# EAGLE board node6.9.10-frontend (EAGLE 5.10)
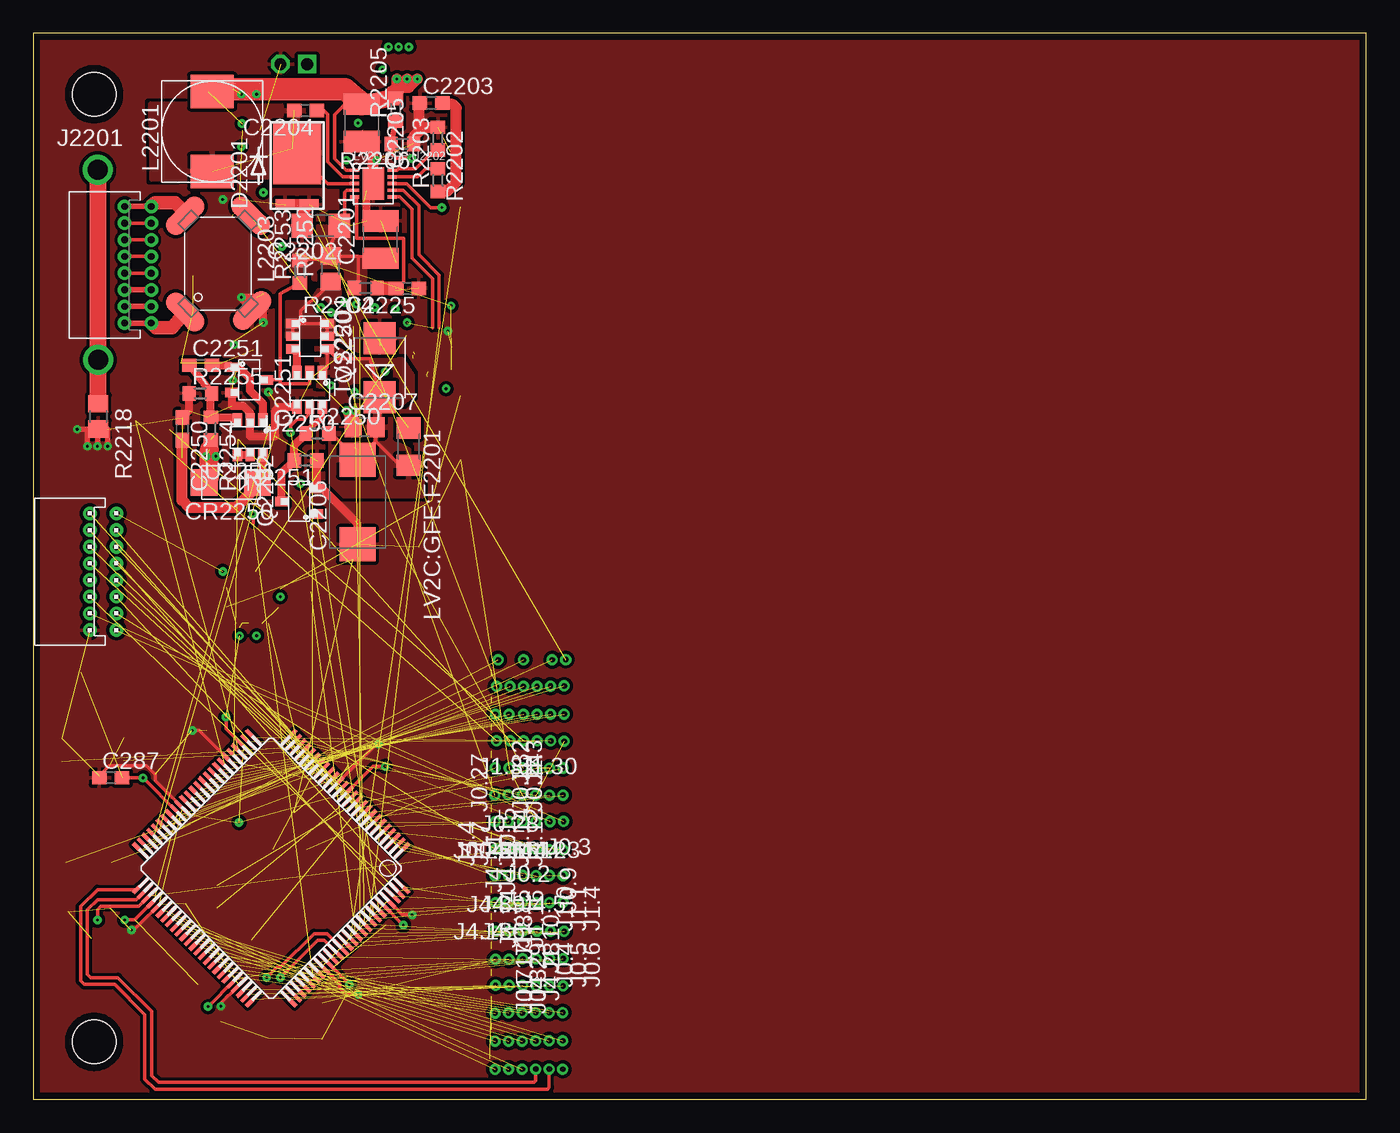
[diagram p2: board, top side]
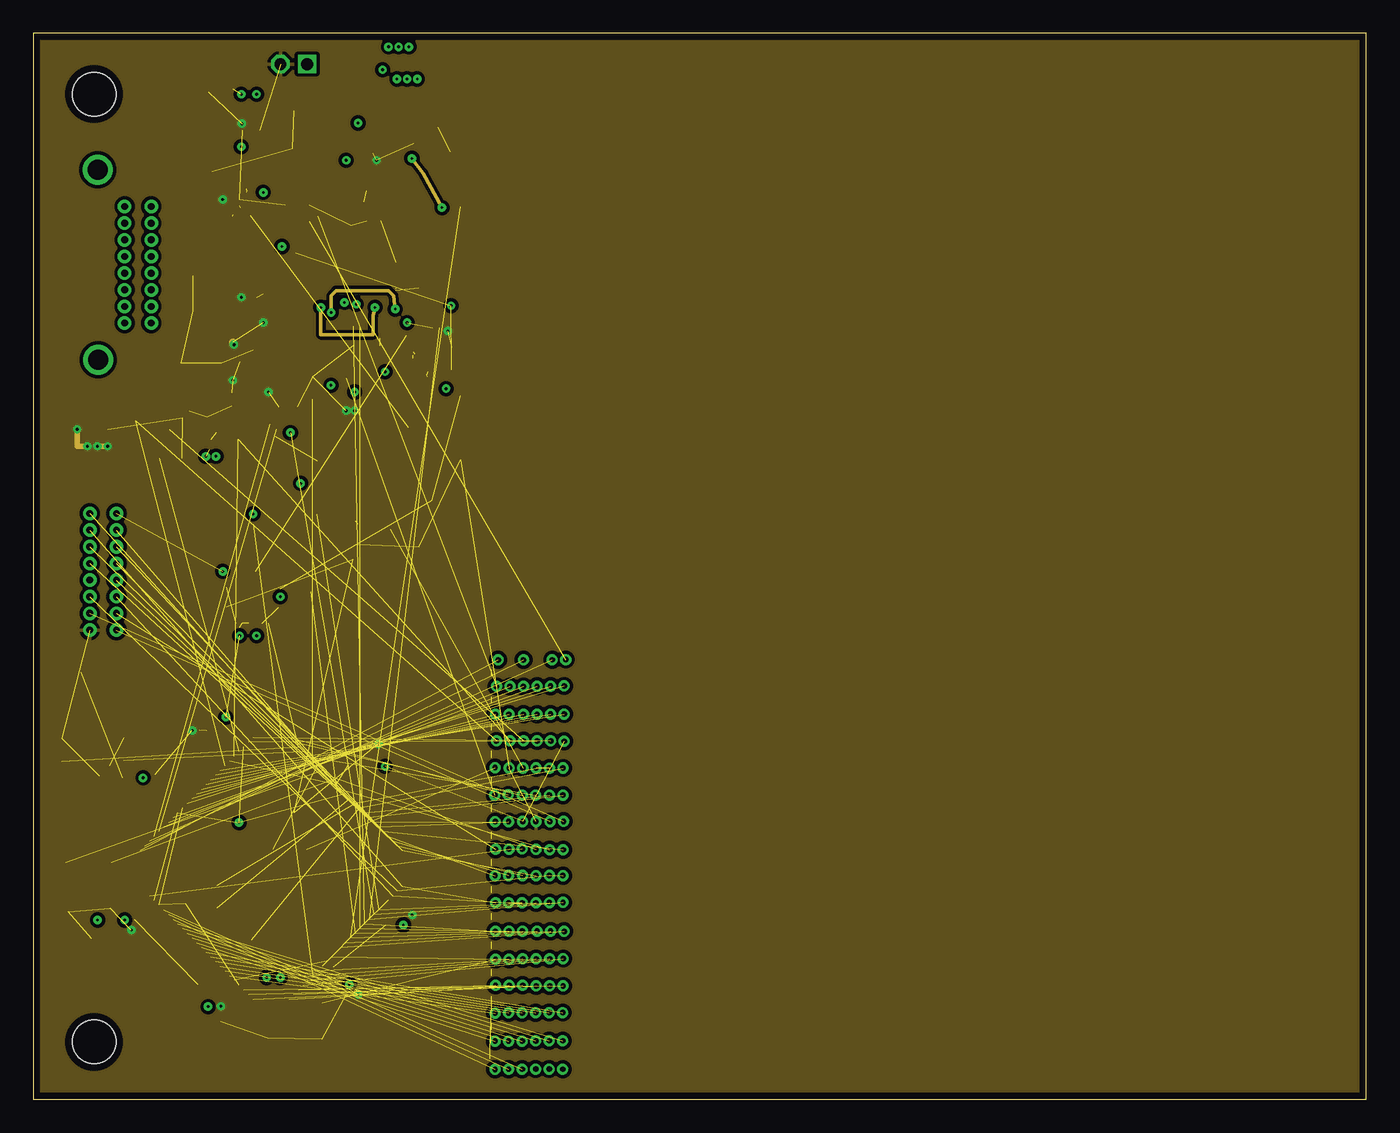
[diagram p3: board, inner layer Route2]
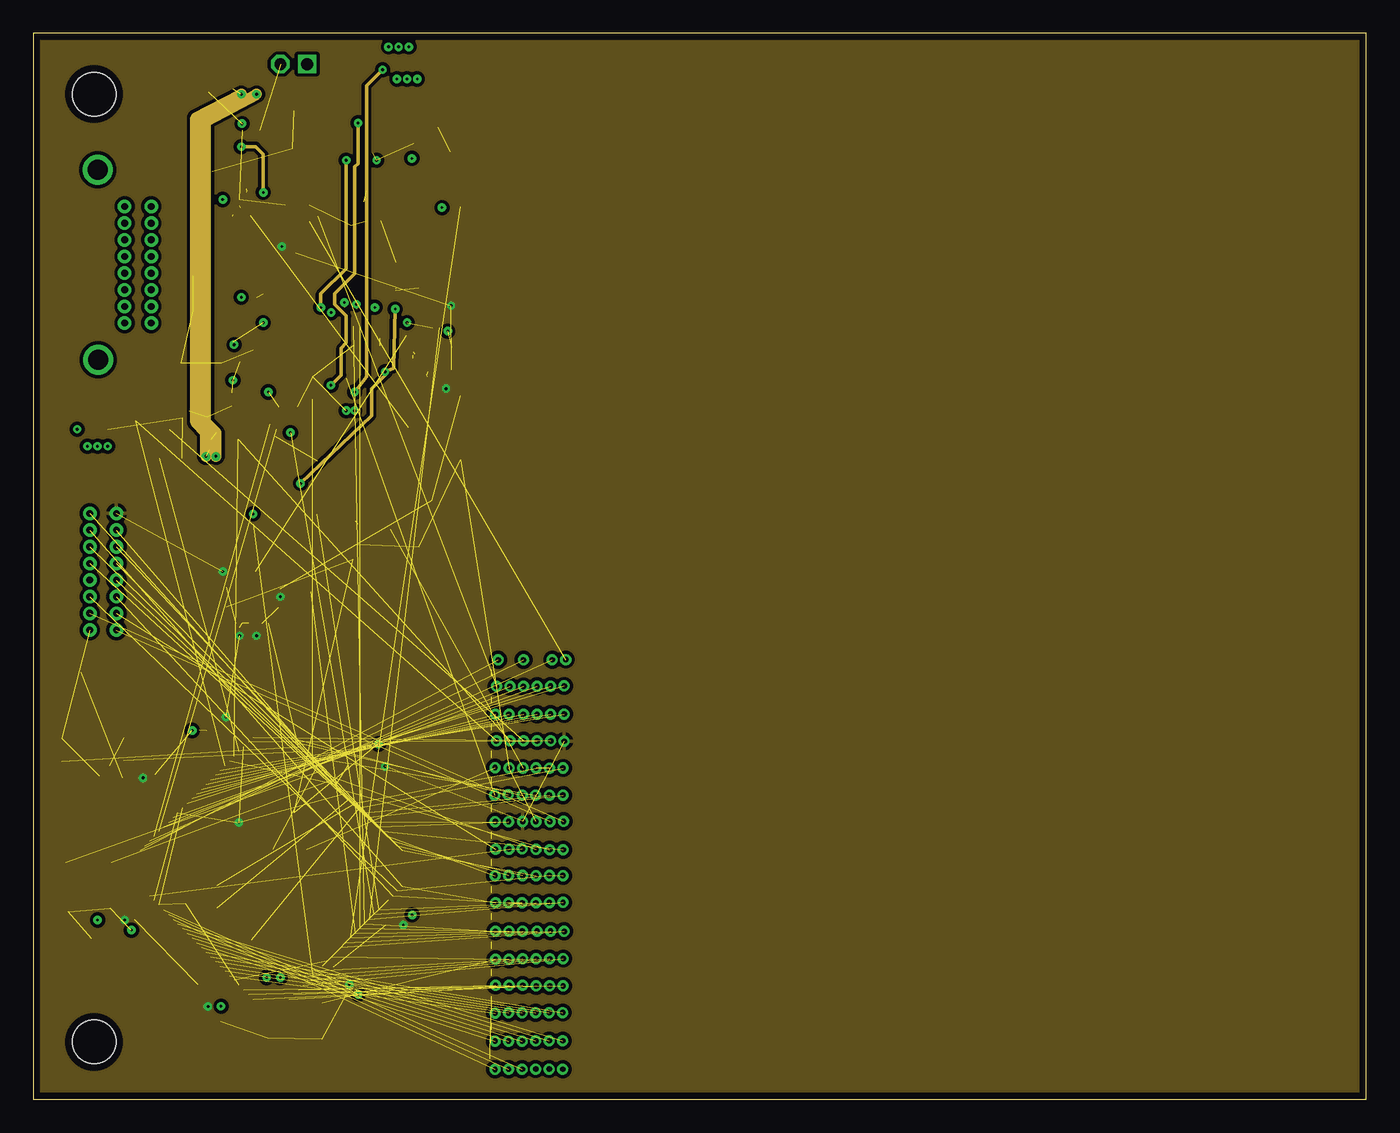
[diagram p4: board, inner layer Route15]
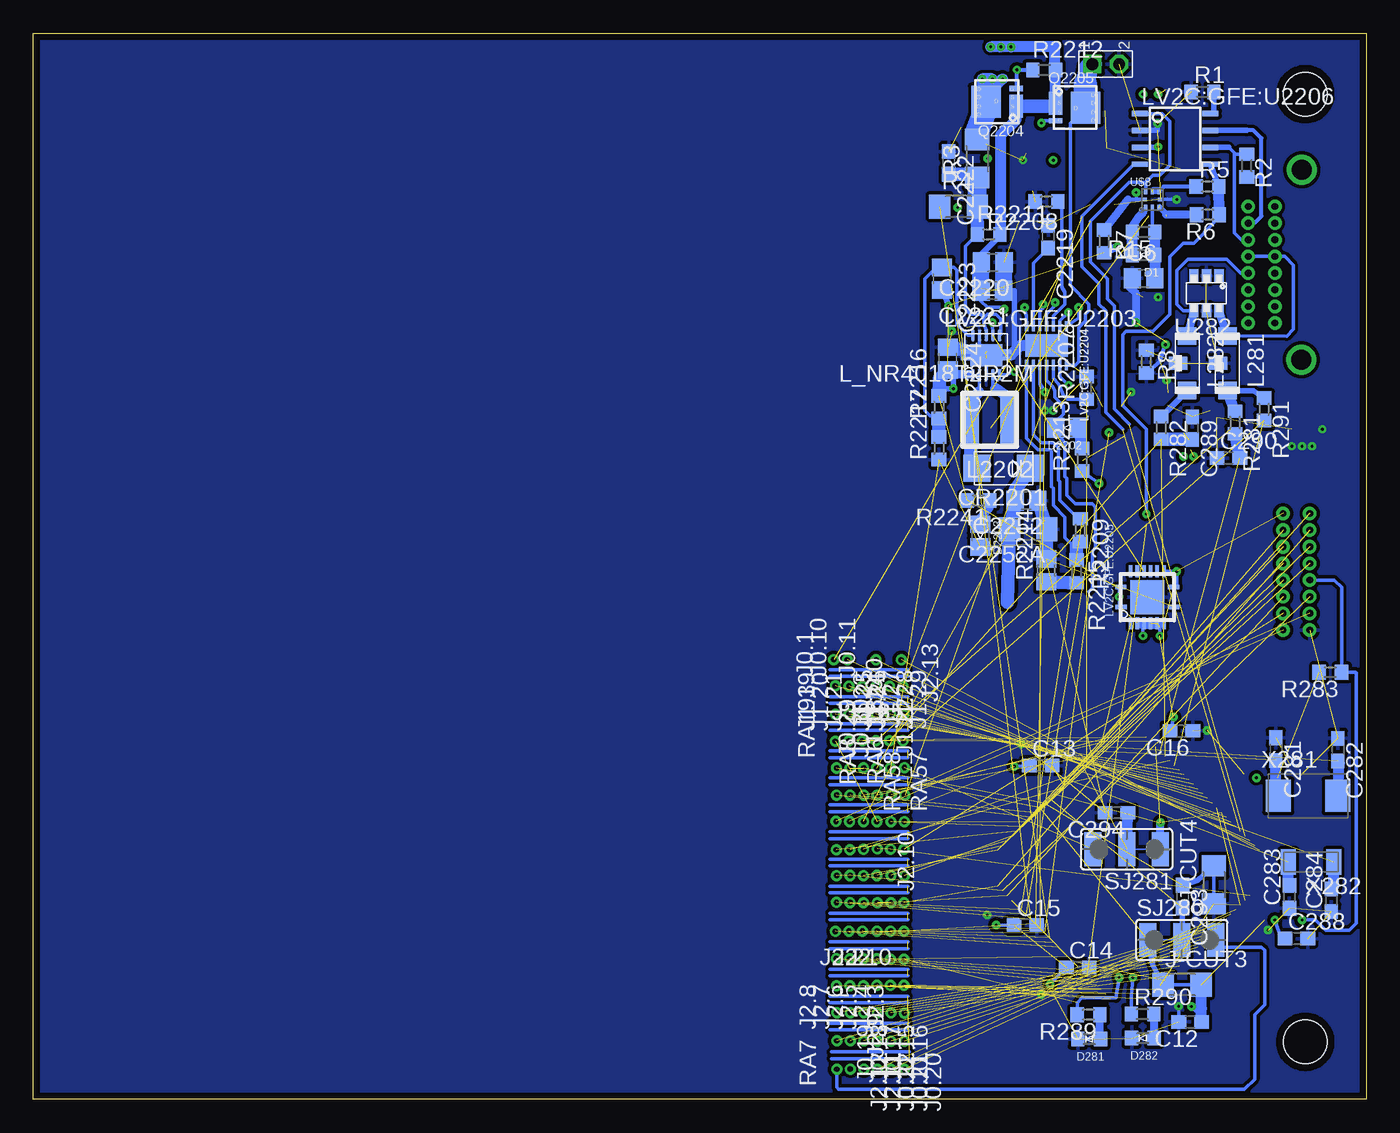
[diagram p5: board, bottom side, seen from below]

Size 100.08 x 80.01 mm. Coordinates in mm from the lower left corner, seen from the top.
Outline: 0,0 100.08,0 100.08,80.01 0,80 0,0
Copper layers (1+2*15+16): Top 0.0432mm / dielectric 0.3048mm / Route2 0.0356mm / dielectric 0.7112mm / Route15 0.0356mm / dielectric 0.3023mm / Bottom 0.0432mm
Design rules "sunstone_4lr_rules_v1.3_modifid *": minimum track width 6mil, minimum drill 8mil, track to track 6mil, track to pad 6mil, pad to pad 6mil, via to via 6mil, smd to smd 6mil, copper to edge 20mil, drill to drill 16mil, minimum pad ring 0.2118mm, minimum via ring 0.2118mm, stop-mask expansion 3mil, vias tented up to drill 0mil, thermal gap 10mil

## Footprints (pad centres in the part's own frame; a part is rotated, then mirrored left to right if it is on the bottom)
2MM-1X2-HEADER = drill 0.889 pad 1.372 square: 1 0,-1 | drill 0.889 pad 1.372 octagon: 2 0,1
C0805 = smd 1.3 x 1.5: 1 -0.85,0; 2 0.85,0
C0603 = smd 1.1 x 1: 1 -0.85,0; 2 0.85,0
C1210 = smd 1.6 x 2.7: 1 -1.4,0; 2 1.4,0
C1206 = smd 1.6 x 1.8: 1 -1.4,0; 2 1.4,0
D/7343-31R = smd 2.55 x 2.7: + 3.175,0; - -3.175,0
NMINIP2-J1 = smd 2 x 2: A 2,0; C -2,0
0603-DIODE = smd 1 x 1.1: A -0.85,0; K 0.85,0
D_POWERDI5 = smd 0.8 x 1.4: ANODE1 -3.47,-0.8; ANODE2 -3.47,1 | smd 4.7 x 3.6: CATHODE 0.4,0.1
0805-DIODE = smd 1.3 x 1.5: 1(ANODE) -0.85,0; 2(CATHODE) 0.85,0
0805-DIODE@1 = smd 1.3 x 1.5: 1(ANODE) -0.85,0; 2(CATHODE) 0.85,0
PAD_ROUND-APC-FREE_0.1/016 = drill 0.406 round: PAD 0,0
ROCKETBUS-PKG = drill 0.508 pad 1.016 round: AUX_1@1 0,-1.875; AUX_1@2 2,-1.875; AUX_2@1 0,-3.125; AUX_2@2 2,-3.125; B+@1 0,4.375; B+@2 2,4.375; B-@1 0,-4.375; B-@2 2,-4.375; CAN_H@1 0,3.125; CAN_H@2 2,3.125; CAN_L@1 0,1.875; CAN_L@2 2,1.875; USB_H@1 0,0.625; USB_H@2 2,0.625; USB_L@1 0,-0.625; USB_L@2 2,-0.625 | drill 1.511 round: CHASSIS@1 -2.032,7.136; CHASSIS@2 -1.982,-7.136
JST-16PS-JED = drill 0.508 pad 1.016 round: 1 4.375,-2; 2 4.375,0; 3 3.125,-2; 4 3.125,0; 5 1.875,-2; 6 1.875,0; 7 0.625,-2; 8 0.625,0; 9 -0.625,-2; 10 -0.625,0; 11 -1.875,-2; 12 -1.875,0; 13 -3.125,-2; 14 -3.125,0; 15 -4.375,-2; 16 -4.375,0
ZJ1206B = smd 1.6 x 1.803: 1 -1.422,0; 2 1.422,0
STAND-OFF = hole 3.302: 0,0
EXC-CET@1 = smd 1.3 x 1.4: 1 -2.05,0; 2 2.05,0 | smd 1 x 1.4: C 0,-0.7
L-DR74 = smd 2.5 x 3.25: 1 -3,0; 2 3,0
L_NR4018 = smd 1.2 x 3.7: 1 -1.4,0; 2 1.4,0
CMS1 = smd 3.5 x 1.5 rotated 45: 1 3.608,-2.462; 3 -3.608,2.462 | smd 3.5 x 1.5 rotated 315: 2 3.508,2.562; 4 -3.608,-2.462
1206 = smd 1.6 x 1.8: 1 -1.4,0; 2 1.4,0
LQFP100 = smd 0.28 x 1.5: #RESET 2,-7.9; #RSTOUT 0.5,-7.9; #TRST -4.5,-7.9; P0[15]/TXD1/SCK0/SCK 0.5,7.9; P0[16]/RXD1/SSEL0/SSEL 0,7.9; P0[17]/CTS1/MISO0/MISO 1,7.9; P0[18]/DCD1/MOSI0/MOSI 1.5,7.9; P0[19]/DSR1/MCICLK/SDA1 2,7.9; P0[20]/DTR1/MCICMD/SCL1 2.5,7.9; P0[21]/RI1/MCIPWR/RD1 3,7.9; P0[22]/RTS1/MCIDAT0/TD1 3.5,7.9; P0[23]/AD0[0]/I2SRX_CLK/CAP3[0] -2,-7.9; P0[24]/AD0[1]/I2SRX_WS/CAP3[1] -2.5,-7.9; P0[25]/AD0[2]/I2SRX_SDA/TXD3 -3,-7.9; P0[26]/AD0[3]/AOUT/RXD3 -3.5,-7.9; P0[27]/SDA0 6,-7.9; P0[28]/SCL0 5.5,-7.9; P1[30]/VBUS/AD0[4] 4,-7.9; P1[31]/SCK1/AD0[5] 3.5,-7.9; P2[0]/PWM1[1]/TXD1/TRACECLK -6,7.9; P2[1]/PWM1[2]/RXD1/PIPESTAT0 -5.5,7.9; P2[2]/PWM1[3]/CTS1/PIPESTAT1 -5,7.9; P2[3]/PWM1[4]/DCD1/PIPESTAT2 -3.5,7.9; P2[4]/PWM1[5]/DSR1/TRACESYNC -3,7.9; P2[5]/PWM1[6]/DTR1/TRACEPKT0 -2.5,7.9; P2[6]/PCAP1[0]/RI1/TRACEPKT1 -2,7.9; P2[7]/RD2/RTS1/TRACEPKT2 -1.5,7.9; P2[8]/TD2/TXD2/TRACEPKT3 -1,7.9; P2[9]/USB_CONNECT/RXD2/EXTIN0 -0.5,7.9; P2[10]/#EINT0 5,7.9; P2[11]/#EINT1/MCIDAT1/I2STX_CLK 5.5,7.9; P2[12]/#EINT2/MCIDAT2/I2STX_WS 6,7.9; RTCX1 1.5,-7.9; RTCX2 2.5,-7.9; TCK -4,-7.9; TDI -5.5,-7.9; TDO -6,-7.9; TMS -5,-7.9; VBAT 3,-7.9; VDD(3V3)@1 4.5,7.9; VDD(3V3)@2 -4,7.9; VDD(DCDC)(3V3) 0,-7.9; VDDA -1.5,-7.9; VREF -0.5,-7.9; VSS 1,-7.9; VSS@3 4,7.9; VSS@4 -4.5,7.9; VSSA -1,-7.9; XTAL1 4.5,-7.9; XTAL2 5,-7.9 | smd 1.5 x 0.28: P0[0]/RD1/TXD3/SDA1 7.9,4; P0[1]/TD1/RXD3/SCL1 7.9,4.5; P0[2]/TXD0 -7.9,-5; P0[3]/RXD0 -7.9,-5.5; P0[4]/I2SRX_CLK/RD2/CAP2[0] -7.9,3.5; P0[5]/I2SRX_WS/TD2/CAP2[1] -7.9,4; P0[6]/I2SRX_SDA/SSEL1/MAT2[0] -7.9,4.5; P0[7]/I2STX_CLK/SCK1/MAT2[1] -7.9,5; P0[8]/I2STX_WS/MISO1/MAT2[2] -7.9,5.5; P0[9]/I2STX_SDA/MOSI1/MAT2[3] -7.9,6; P0[10]/TXD2/SDA2/MAT3[0] 7.9,5; P0[11]/RXD2/SCL2/MAT3[1] 7.9,5.5; P0[29]/USB_D+ 7.9,-4.5; P0[30]/USB_D- 7.9,-4; P1[0]/ENET_TXD0 -7.9,-3.5; P1[1]/ENET_TXD1 -7.9,-3; P1[4]/ENET_TX_EN -7.9,-2.5; P1[8]/ENET_CRS -7.9,-2; P1[9]/ENET_RXD0 -7.9,-1.5; P1[10]/ENET_RXD1 -7.9,-1; P1[14]/ENET_RX_ER -7.9,-0.5; P1[15]/ENET_REF_CLK -7.9,0; P1[16]/ENET_MDC -7.9,0.5; P1[17]/ENET_MDIO -7.9,1; P1[18]/USB_UP_LED/PWM1[1]/CAP1[0] 7.9,-3; P1[19]/CAP1[1] 7.9,-2.5; P1[20]/PWM1[2]/SCK0 7.9,-2; P1[21]/PWM1[3]/SSEL0 7.9,-1.5; P1[22]MAT1[0] 7.9,-1; P1[23]/PWM1[4]/MISO0 7.9,-0.5; P1[24]/PWM1[5]/MOSI0 7.9,0; P1[25]/MAT1[1] 7.9,0.5; P1[26]/PWM1[6]/CAP0[0] 7.9,1; P1[27]/CAP0[1] 7.9,2.5; P1[28]/PCAP1[0]/MAT0[0] 7.9,3; P1[29]/PCAP1[1]/MAT0[1] 7.9,3.5; P2[13]/#EINT3/MCIDAT3/I2STX_SDA 7.9,6; P3[25]/MAT0[0]/PWM1[2] 7.9,-5.5; P3[26]/MAT0[1]/PWM1[3] 7.9,-6; P4[28]/MAT2[0]/TXD3 -7.9,3; P4[29]/MAT2[1]/RXD3 -7.9,1.5; RTCK -7.9,-6; VDD(3V3) 7.9,-5; VDD(3V3)@3 -7.9,-4; VDD(DCDC)(3V3)@1 7.9,2; VDD(DCDC)(3V3)@2 -7.9,2; VSS@1 7.9,-3.5; VSS@2 7.9,1.5; VSS@5 -7.9,-4.5; VSS@6 -7.9,2.5
DFN-10 = smd 0.25 x 0.675: BD -1,-1.413; BOOST -0.5,-1.413; FB 0,1.413; PG 0.5,1.413; RT -1,1.413; RUN/SS 1,-1.413; SW 0,-1.413; SYNC 1,1.413; VC -0.5,1.413; VIN 0.5,-1.413 | smd 2.38 x 1.65: GND 0,0
SON-10 = smd 0.28 x 0.85: EN 1,1.475; FB -1,1.475; GND -0.5,1.475; L1 0.5,-1.475; L2 -0.5,-1.475; PGND 0,-1.475; PS/SYNC 0.5,1.475; VIN 1,-1.475; VINA 0,1.475; VOUT -1,-1.475 | smd 2.4 x 1.65: PGND@1 0,0 | smd 3.8 x 0.28: PGND@2 0,0.25; PGND@3 0,-0.25
DFN-14 = smd 0.25 x 0.7: 1 -1.5,-1.45; 2 -1,-1.45; 3 -0.5,-1.45; 4 0,-1.45; 5 0.5,-1.45; 6 1,-1.45; 7 1.5,-1.45; 8 1.5,1.45; 9 1,1.45; 10 0.5,1.45; 11 0,1.45; 12 -0.5,1.45; 13 -1,1.45; 14 -1.5,1.45 | smd 3.3 x 1.7: PGND 0,0
QFN-16 = smd 0.85 x 0.28: 1 -1.97,-0.75; 8 1.97,-0.74; 9 1.97,0.75; 16 -1.98,0.75 | smd 0.28 x 0.85: 2 -1.25,-1.95; 3 -0.75,-1.95; 4 -0.25,-1.95; 5 0.25,-1.95; 6 0.75,-1.95; 7 1.25,-1.95; 10 1.25,1.95; 11 0.75,1.95; 12 0.25,1.95; 13 -0.25,1.95; 14 -0.75,1.95; 15 -1.25,1.95 | smd 2.55 x 2.55: PGND 0,0
DR-PDSO-G8 = smd 0.4 x 1.2: 1 -1.905,-2.65; 2 -0.635,-2.65; 3 0.635,-2.65; 4 1.905,-2.65; 5 1.905,2.65; 6 0.635,2.65; 7 -0.635,2.65; 8 -1.905,2.65
1212-8_POWERPAK = smd 0.99 x 1.725: 1-2-3 -1.45,0.33 | smd 0.99 x 0.405: 4 -1.45,-0.99 | smd 2.24 x 2.39: 5-6-7-8 0.797,0
SOT23-6 = smd 0.7 x 1: 1 -0.95,-1.3; 2 0,-1.3; 3 0.95,-1.3; 4 0.95,1.3; 5 0,1.3; 6 -0.95,1.3
SOT23-3 = smd 0.7 x 1: 1 -0.95,-1.3; 2 0.95,-1.3; 3 0,1.3
R0603 = smd 1 x 1.1: 1 -0.85,0; 2 0.85,0
R1206 = smd 1.6 x 1.803: 1 -1.422,0; 2 1.422,0
R0805 = smd 1.3 x 1.5: 1 -0.85,0; 2 0.85,0
R0805' = smd 1.3 x 1.5: 1 -0.95,0; 2 0.95,0
SJ_2W = smd 1.27 x 2.54: 1 -2.54,0; 2 0,0; 3 2.54,0
SMB = smd 2.4 x 2.4: A 2.2,0; C -2.2,0
MICROPAK-8 = smd 0.25 x 0.4: 1 -0.5,-0.61; 2 0,-0.61; 3 0.5,-0.61; 5 0.5,0.61; 6 0,0.61; 7 -0.5,0.61 | smd 0.4 x 0.25: 4 0.6,0; 8 -0.6,0
CS10 = smd 1.905 x 2.413: P$1 -2.235,0; P$2 2.235,0
CM415 = smd 1.118 x 1.905: P$1 -1.702,0; P$2 1.702,0

## Placement (x,y rotation side)
B1  BATTERY_SINGLE_CELL_2MM  [2MM-1X2-HEADER]  19.56,77.7 270 bottom
C6  76nF  [C0805]  16.71,61.62 0 bottom
C12  0.1  [C0603]  13.22,5.82 180 bottom
C13  0.1  [C0603]  24.43,25.04 0 bottom
C14  0.1  [C0603]  21.67,9.91 0 bottom
C15  0.1  [C0603]  25.59,13.08 0 bottom
C16  0.1  [C0603]  13.87,27.66 180 bottom
C281  39 pF  [C0603]  6.78,26.29 270 bottom
C282  33 pF  [C0603]  2.13,26.24 270 bottom
C283  22 pF  [C0603]  5.77,15.19 90 bottom
C284  22 pF  [C0603]  2.62,14.94 90 bottom
C287  0.1  [C0603]  5.82,24.13 0 top
C288  0.1  [C0603]  5.23,12.06 0 bottom
C289  18pF  [C0603]  13.06,50.37 270 bottom
C290  18pF  [C0603]  10.34,48.13 0 bottom
C293  0.1  [C0603]  13.79,15.21 270 bottom
C294  0.1  [C0603]  18.75,21.51 180 bottom
C2201  10uF  [C1210]  26.06,64.53 90 top
C2202  1uF  [C1206]  21.59,65.56 180 top
C2203  680pF  [C0603]  29.87,74.77 0 top
C2204  0.22uF  [C0603]  20.44,74.22 180 top
C2205  22uF  [C1210]  24.67,73.28 270 top
C2206  22  [D/7343-31R]  24.35,44.83 90 top
C2207  0.33  [C0805]  24.87,50.44 0 top
C2219  depends on bat  [C0603]  23.88,64.74 270 bottom
C2220  4.7uF  [C0805]  28.04,62.81 180 bottom
C2221  4.7uF  [C0805]  28.07,60.71 180 bottom
C2222  0.1uF  [C0603]  31.34,70.28 270 bottom
C2223  2pF  [C0805]  31.85,61.59 270 bottom
C2224  22uF  [C0805]  31.42,55.6 270 bottom
C2225  0.1uF  [C0603]  28.09,60.86 180 top
C2250  2.7  [C0603]  11.2,50.32 270 top
C2251  0.015  [C0603]  12.57,55.09 0 top
C2252  TBD  [C0805]  25.5,44.93 180 bottom
C2252A  TBD  [C1206]  25.37,42.8 180 bottom
CR2201  MA2Q705  [NMINIP2-J1]  27.23,47.37 180 bottom
CR2250  MA2Q705  [NMINIP2-J1]  14.83,46.3 180 top
D1  CDSU101A  [0603-DIODE]  16.71,63.37 180 bottom
D281  LED-RED-0603  [0603-DIODE]  20.8,4.52 180 bottom
D282  LED-GRN-  [0603-DIODE]  16.76,4.6 180 bottom
D2201  D_PDS340  [D_POWERDI5]  19.91,70.63 90 top
D2202  LED-RED-0805  [0805-DIODE]  22.48,50.39 180 bottom
D2203  LED-ORG-0805  [0805-DIODE@1]  28.98,42.32 270 bottom
J0.0  PAD_ROUND016  [PAD_ROUND-APC-FREE_0.1/016]  34.77,30.99 90 bottom
J0.1  PAD_ROUND016  [PAD_ROUND-APC-FREE_0.1/016]  39.98,33.01 90 bottom
J0.2  PAD_ROUND016  [PAD_ROUND-APC-FREE_0.1/016]  36.7,14.76 0 top
J0.3  PAD_ROUND016  [PAD_ROUND-APC-FREE_0.1/016]  39.76,16.79 0 top
J0.4  PAD_ROUND016  [PAD_ROUND-APC-FREE_0.1/016]  37.76,10.54 270 top
J0.5  PAD_ROUND016  [PAD_ROUND-APC-FREE_0.1/016]  38.77,10.55 270 top
J0.6  PAD_ROUND016  [PAD_ROUND-APC-FREE_0.1/016]  39.79,10.57 270 top
J0.7  PAD_ROUND016  [PAD_ROUND-APC-FREE_0.1/016]  34.71,8.55 270 top
J0.8  PAD_ROUND016  [PAD_ROUND-APC-FREE_0.1/016]  35.73,8.55 270 top
J0.9  PAD_ROUND016  [PAD_ROUND-APC-FREE_0.1/016]  36.74,8.56 270 top
J0.10  PAD_ROUND016  [PAD_ROUND-APC-FREE_0.1/016]  38.96,32.99 90 bottom
J0.11  PAD_ROUND016  [PAD_ROUND-APC-FREE_0.1/016]  36.8,32.98 90 bottom
J0.15  PAD_ROUND016  [PAD_ROUND-APC-FREE_0.1/016]  36.7,4.37 270 bottom
J0.16  PAD_ROUND016  [PAD_ROUND-APC-FREE_0.1/016]  35.69,4.37 270 bottom
J0.17  PAD_ROUND016  [PAD_ROUND-APC-FREE_0.1/016]  37.72,4.38 270 bottom
J0.18  PAD_ROUND016  [PAD_ROUND-APC-FREE_0.1/016]  38.73,4.39 270 bottom
J0.19  PAD_ROUND016  [PAD_ROUND-APC-FREE_0.1/016]  39.75,4.39 270 bottom
J0.20  PAD_ROUND016  [PAD_ROUND-APC-FREE_0.1/016]  34.67,2.25 270 bottom
J0.21  PAD_ROUND016  [PAD_ROUND-APC-FREE_0.1/016]  35.69,2.26 270 bottom
J0.22  PAD_ROUND016  [PAD_ROUND-APC-FREE_0.1/016]  36.7,2.26 270 bottom
J0.23  PAD_ROUND016  [PAD_ROUND-APC-FREE_0.1/016]  38.75,22.83 90 top
J0.24  PAD_ROUND016  [PAD_ROUND-APC-FREE_0.1/016]  39.76,22.83 90 top
J0.25  PAD_ROUND016  [PAD_ROUND-APC-FREE_0.1/016]  34.68,20.84 180 top
J0.26  PAD_ROUND016  [PAD_ROUND-APC-FREE_0.1/016]  35.69,20.84 180 top
J0.27  PAD_ROUND016  [PAD_ROUND-APC-FREE_0.1/016]  35.66,22.85 90 top
J0.28  PAD_ROUND016  [PAD_ROUND-APC-FREE_0.1/016]  36.72,22.83 180 top
J0.29  PAD_ROUND016  [PAD_ROUND-APC-FREE_0.1/016]  36.8,26.91 90 bottom
J0.30  PAD_ROUND016  [PAD_ROUND-APC-FREE_0.1/016]  35.79,26.91 90 bottom
J1.0  PAD_ROUND016  [PAD_ROUND-APC-FREE_0.1/016]  37.74,14.75 270 top
J1.1  PAD_ROUND016  [PAD_ROUND-APC-FREE_0.1/016]  38.76,14.76 270 top
J1.2  PAD_ROUND016  [PAD_ROUND-APC-FREE_0.1/016]  38.75,24.85 90 top
J1.3  PAD_ROUND016  [PAD_ROUND-APC-FREE_0.1/016]  39.76,24.87 90 top
J1.4  PAD_ROUND016  [PAD_ROUND-APC-FREE_0.1/016]  39.77,14.78 270 top
J1.8  PAD_ROUND016  [PAD_ROUND-APC-FREE_0.1/016]  34.69,12.62 270 top
J1.9  PAD_ROUND016  [PAD_ROUND-APC-FREE_0.1/016]  35.71,12.63 270 top
J1.10  PAD_ROUND016  [PAD_ROUND-APC-FREE_0.1/016]  36.72,12.63 270 top
J1.14  PAD_ROUND016  [PAD_ROUND-APC-FREE_0.1/016]  37.82,12.62 90 top
J1.15  PAD_ROUND016  [PAD_ROUND-APC-FREE_0.1/016]  38.84,12.62 90 top
J1.16  PAD_ROUND016  [PAD_ROUND-APC-FREE_0.1/016]  39.85,12.61 90 top
J1.17  PAD_ROUND016  [PAD_ROUND-APC-FREE_0.1/016]  34.71,10.5 270 top
J1.18  PAD_ROUND016  [PAD_ROUND-APC-FREE_0.1/016]  34.77,26.9 90 bottom
J1.19  PAD_ROUND016  [PAD_ROUND-APC-FREE_0.1/016]  39.85,28.92 90 bottom
J1.20  PAD_ROUND016  [PAD_ROUND-APC-FREE_0.1/016]  38.84,28.92 90 bottom
J1.21  PAD_ROUND016  [PAD_ROUND-APC-FREE_0.1/016]  37.82,28.91 90 bottom
J1.22  PAD_ROUND016  [PAD_ROUND-APC-FREE_0.1/016]  36.8,28.89 270 bottom
J1.23  PAD_ROUND016  [PAD_ROUND-APC-FREE_0.1/016]  35.71,28.91 90 bottom
J1.24  PAD_ROUND016  [PAD_ROUND-APC-FREE_0.1/016]  34.7,28.91 90 bottom
J1.25  PAD_ROUND016  [PAD_ROUND-APC-FREE_0.1/016]  39.85,31.03 270 bottom
J1.26  PAD_ROUND016  [PAD_ROUND-APC-FREE_0.1/016]  38.84,31.01 270 bottom
J1.27  PAD_ROUND016  [PAD_ROUND-APC-FREE_0.1/016]  37.82,31 270 bottom
J1.28  PAD_ROUND016  [PAD_ROUND-APC-FREE_0.1/016]  36.8,30.99 270 bottom
J1.29  PAD_ROUND016  [PAD_ROUND-APC-FREE_0.1/016]  35.79,30.99 270 bottom
J1.30  PAD_ROUND016  [PAD_ROUND-APC-FREE_0.1/016]  37.71,22.83 0 top
J1.31  PAD_ROUND016  [PAD_ROUND-APC-FREE_0.1/016]  34.65,22.83 0 top
J2.0  PAD_ROUND016  [PAD_ROUND-APC-FREE_0.1/016]  37.76,8.51 0 bottom
J2.1  PAD_ROUND016  [PAD_ROUND-APC-FREE_0.1/016]  38.77,8.51 0 bottom
J2.2  PAD_ROUND016  [PAD_ROUND-APC-FREE_0.1/016]  39.78,8.51 0 bottom
J2.3  PAD_ROUND016  [PAD_ROUND-APC-FREE_0.1/016]  34.67,6.48 90 bottom
J2.4  PAD_ROUND016  [PAD_ROUND-APC-FREE_0.1/016]  35.69,6.49 90 bottom
J2.5  PAD_ROUND016  [PAD_ROUND-APC-FREE_0.1/016]  36.7,6.49 90 bottom
J2.6  PAD_ROUND016  [PAD_ROUND-APC-FREE_0.1/016]  37.72,6.5 90 bottom
J2.7  PAD_ROUND016  [PAD_ROUND-APC-FREE_0.1/016]  38.73,6.52 90 bottom
J2.8  PAD_ROUND016  [PAD_ROUND-APC-FREE_0.1/016]  39.75,6.52 90 bottom
J2.9  PAD_ROUND016  [PAD_ROUND-APC-FREE_0.1/016]  34.67,4.37 90 bottom
J2.10  PAD_ROUND016  [PAD_ROUND-APC-FREE_0.1/016]  36.7,18.8 270 bottom
J2.11  PAD_ROUND016  [PAD_ROUND-APC-FREE_0.1/016]  37.72,2.27 270 bottom
J2.12  PAD_ROUND016  [PAD_ROUND-APC-FREE_0.1/016]  38.73,2.27 270 bottom
J2.13  PAD_ROUND016  [PAD_ROUND-APC-FREE_0.1/016]  34.9,32.98 270 bottom
J3.25  PAD_ROUND016  [PAD_ROUND-APC-FREE_0.1/016]  37.83,26.9 0 bottom
J3.26  PAD_ROUND016  [PAD_ROUND-APC-FREE_0.1/016]  38.85,26.9 0 bottom
J4.1  PAD_ROUND016  [PAD_ROUND-APC-FREE_0.1/016]  37.74,20.85 180 top
J4.2  PAD_ROUND016  [PAD_ROUND-APC-FREE_0.1/016]  38.79,20.85 180 top
J4.3  PAD_ROUND016  [PAD_ROUND-APC-FREE_0.1/016]  39.81,20.87 180 top
J4.4  PAD_ROUND016  [PAD_ROUND-APC-FREE_0.1/016]  34.7,18.77 90 top
J4.5  PAD_ROUND016  [PAD_ROUND-APC-FREE_0.1/016]  38.75,16.8 180 top
J4.6  PAD_ROUND016  [PAD_ROUND-APC-FREE_0.1/016]  35.69,14.76 180 top
J4.7  PAD_ROUND016  [PAD_ROUND-APC-FREE_0.1/016]  35.71,18.78 90 top
J4.8  PAD_ROUND016  [PAD_ROUND-APC-FREE_0.1/016]  34.67,16.79 180 top
J4.9  PAD_ROUND016  [PAD_ROUND-APC-FREE_0.1/016]  35.69,16.8 180 top
J4.10  PAD_ROUND016  [PAD_ROUND-APC-FREE_0.1/016]  37.74,16.79 90 top
J4.11  PAD_ROUND016  [PAD_ROUND-APC-FREE_0.1/016]  36.74,16.8 90 top
J4.12  PAD_ROUND016  [PAD_ROUND-APC-FREE_0.1/016]  39.79,18.73 90 top
J4.13  PAD_ROUND016  [PAD_ROUND-APC-FREE_0.1/016]  34.7,14.76 180 top
J4.14  PAD_ROUND016  [PAD_ROUND-APC-FREE_0.1/016]  38.77,18.73 90 top
J4.15  PAD_ROUND016  [PAD_ROUND-APC-FREE_0.1/016]  37.74,18.76 90 top
J4.16  PAD_ROUND016  [PAD_ROUND-APC-FREE_0.1/016]  36.74,20.85 180 top
J4.28  PAD_ROUND016  [PAD_ROUND-APC-FREE_0.1/016]  36.74,10.54 270 top
J4.29  PAD_ROUND016  [PAD_ROUND-APC-FREE_0.1/016]  35.71,10.5 270 top
J2201  ROCKETBUS  [ROCKETBUS-PKG]  6.86,62.64 0 top
J2204  JST-16PS-JED  [JST-16PS-JED]  4.24,39.6 90 top
J-CUT3  J_CUT_1206  [ZJ1206B]  13.82,8.61 0 bottom
J-CUT4  J_CUT_1206  [ZJ1206B]  11.43,16.1 90 bottom
JP1  STAND-OFF  [STAND-OFF]  4.57,75.44 0 top
JP2  STAND-OFF  [STAND-OFF]  4.57,4.32 0 top
L281  EXC-CET471U  [EXC-CET@1]  10.41,55.24 270 bottom
L282  FILTER_EMI-EXC-CET  [EXC-CET@1]  13.44,55.24 270 bottom
L2201  L_DR74-6R8-R  [L-DR74]  13.43,72.64 90 top
L2202  L_NR4018T2R2M  [L_NR4018]  28.27,51.01 180 bottom
L2203  CMS1  [CMS1]  13.87,62.71 270 top
LV2C:GFE:F2201  2.0A Fast  [1206]  28.17,49 270 top
LV2C:GFE:U2201  IC_LPC2368  [LQFP100]  17.86,17.35 135 top
LV2C:GFE:U2202  IC_LT3972  [DFN-10]  25.52,68.74 270 top
LV2C:GFE:U2203  IC_TPS63000  [SON-10]  28.53,55.86 0 bottom
LV2C:GFE:U2204  IC_LTC4085  [DFN-14]  24,56.56 180 bottom
LV2C:GFE:U2205  IC_SN74LV163A  [QFN-16]  16.43,37.69 0 bottom
LV2C:GFE:U2206  IC_SN65HVD235  [DR-PDSO-G8]  14.35,72.09 270 bottom
Q2204  P-MOS_SI7123DN  [1212-8_POWERPAK]  27.73,74.87 180 bottom
Q2205  P-MOS_SI7123DN  [1212-8_POWERPAK]  21.86,74.43 0 bottom
Q2250  ZXMP6A17E6TA  [SOT23-6]  20.78,57.28 270 top
Q2251  BSS123E6327  [SOT23-3]  16.21,54 270 top
Q2282  BSS123E6327  [SOT23-3]  19.96,44.88 90 top
R1  18k  [R0603]  12.29,75.62 0 bottom
R2  60  [R0603]  8.97,70.08 270 bottom
R3  100k  [R1206]  29.21,70.61 90 bottom
R4  100k  [R1206]  30.61,67.01 0 bottom
R5  0  [R0603]  11.91,68.5 0 bottom
R6  0  [R0603]  11.89,66.4 180 bottom
R7  0  [R0603]  19.68,64.39 270 bottom
R8  0  [R0603]  16.51,55.37 270 bottom
R15  10k  [R0603]  16.71,65.1 180 bottom
R281  33.2  [R0603]  9.86,50.8 270 bottom
R282  33.2  [R0603]  15.39,50.39 270 bottom
R283  10.0k  [R0603]  2.69,32.05 180 bottom
R289  649  [R0603]  20.85,6.35 180 bottom
R290  649  [R0603]  16.79,6.4 0 bottom
R291  1.5k  [R0603]  7.67,51.79 270 bottom
R2202  26.7k  [R0603]  30.37,72.11 270 top
R2203  15k  [R0603]  30.38,68.99 90 top
R2204  500k  [R0603]  24.97,60.89 180 top
R2205  532k  [R0603]  27.21,74.27 90 top
R2206  100k  [R0603]  27.71,71.71 180 top
R2207  100k  [R0603]  20.98,53.39 90 bottom
R2208  660  [R0603]  24,67.39 180 bottom
R2209  115k 1%  [R0603]  21.46,42.72 270 bottom
R2211  100  [R0603]  28.35,64.92 0 bottom
R2212  1k  [R0603]  24.18,77.27 0 bottom
R2213  510  [R0603]  21.34,48.01 90 bottom
R2214  Thermistor-100k @25C  [R0805]  24,39.7 90 bottom
R2215  15k 1%  [R0603]  21.74,39.62 270 bottom
R2216  1.0M  [R0603]  32.08,51.94 90 bottom
R2217  200k  [R0603]  32.08,48.87 90 bottom
R2218  100k  [R0805']  4.88,51.26 270 top
R2241  649  [R0603]  29.11,44.96 180 bottom
R2250  61.9k  [R0603]  21.34,49.97 0 top
R2251  10.0k  [R0603]  20.45,47.94 180 top
R2252  0.82  [R0805']  22.32,62.34 90 top
R2253  47k  [R0603]  20.02,62.12 90 top
R2254  33.0k  [R0603]  13.34,50.34 270 top
R2255  10.0k  [R0603]  12.55,52.98 0 top
RA6  t24  [PAD_ROUND-APC-FREE_0.1/016]  34.67,24.89 90 bottom
RA7  t24  [PAD_ROUND-APC-FREE_0.1/016]  39.75,2.26 90 bottom
RA8  t24  [PAD_ROUND-APC-FREE_0.1/016]  36.75,24.87 90 bottom
RA57  t24  [PAD_ROUND-APC-FREE_0.1/016]  35.74,24.87 270 bottom
RA58  t24  [PAD_ROUND-APC-FREE_0.1/016]  37.74,24.87 270 bottom
RA193  3P3  [PAD_ROUND-APC-FREE_0.1/016]  39.85,26.87 90 bottom
SJ280  [SJ_2W]  13.84,11.96 0 bottom
SJ281  [SJ_2W]  17.98,18.77 180 bottom
TVS2201  SMBJ18A  [SMB]  26,54.91 90 top
U282  SN65220DBVR  [SOT23-6]  11.99,60.5 180 bottom
U2250  MAX5902AAETT  [SOT23-6]  20.75,53.26 180 top
U2251  TLV3012AIDBVT  [SOT23-6]  16.28,49.68 180 top
U$8  IC_NC7NP14  [MICROPAK-8]  16.05,67.54 0 bottom
X281  12.0 MHz  [CS10]  4.37,22.78 0 bottom
X282  32.768 kHz  [CM415]  4.14,17.81 180 bottom

## Tracks (layer width: path | path; a pad name or v marks a point on that pad's centre or on a via)
3.3V_HAP_OUT  (via drill 0.2)  (22 unrouted)
  Top 0.254: v23.74,8.64 LV2C:GFE:U2201.VDD(DCDC)(3V3)@2 | LV2C:GFE:U2201.VDD(3V3)@3 v27.78,13.08 | LV2C:GFE:U2201.VDD(DCDC)(3V3)@1 v8.25,24.13 C287.2 | LV2C:GFE:U2201.VDD(3V3) 14.48,27.8 14.48,28.66 v14.46,28.69 | LV2C:GFE:U2201.VDD(DCDC)(3V3) 25.5,24.99 v26.42,24.99 | v13.12,6.96 LV2C:GFE:U2201.VDD(3V3)@2 | LV2C:GFE:U2201.VDD(3V3)@1 7.61,13.46 v6.86,13.46
  Bottom 0.254: C2224.2 31.42,54.38 LV2C:GFE:U2203.VOUT | 29.59,54.23 30.86,54.23 | 29.59,54.61 30.99,54.61 | C16.2 v14.46,28.69 | v27.78,13.08 C15.1 | C14.1 v23.74,8.64 | v26.42,24.99 C13.1 | LV2C:GFE:U2205.9 14.22,38.68 v14.22,39.62 14.24,39.64 LV2C:GFE:U2205.10 | LV2C:GFE:U2205.4 LV2C:GFE:U2205.3 16.76,35.32 v16.76,34.8 | LV2C:GFE:U2205.7 15.49,35.43 v15.49,34.8 | LV2C:GFE:U2205.1 18.54,37.08 v18.54,37.72 18.54,38.31 LV2C:GFE:U2205.16 | C12.1 12.37,6.21 v13.12,6.96 | C288.1 6.34,11.92 v6.86,13.46
  Bottom 0.406: C2223.2 31.75,60.64 v31.37,59.56 | C2224.2 30.99,54.32 v30.99,53.34 32,53.34
  Bottom 0.61: R7.2 19.3,63.75 v18.67,64.01 | SJ281.1 v15.44,20.78
  Bottom 0.813: LV2C:GFE:U2205.4 LV2C:GFE:U2205.6 | C12.1 12.37,6.83 J-CUT3.2
  Bottom 1.016: R2216.2 32.05,54.09 C2224.2
  pour Route15 (isolate 0.254, rank 4): 0,80.01 100.08,80.01 100.08,0 0,0
!RESET!  (2 unrouted)
!RSTOUT!  (2 unrouted)
!SPS_POWER_PRESENT!  (via drill 0.2)
  Route15 0.254: v24.13,53.09 25.02,54.23 25.02,76.07 v26.23,77.28
  Bottom 0.254: LV2C:GFE:U2204.10 24.5,53.71 v24.13,53.09 | 26.28,77.27 26.24,77.27 v26.23,77.28
  Bottom 0.305: Q2204.4 26.28,77.27 R2212.1
!TRST!  (2 unrouted)
A_3P3  (2 unrouted)
  Bottom 0.406: SJ280.1 16,10.06 J-CUT3.1
A_GND  (3 unrouted)
  Bottom 0.406: J-CUT4.2 12.64,16.45 C293.1
AUX_1.2
  Top 0.406: J2201.AUX_1@1 J2201.AUX_1@2
AUX_2.2
  Top 0.406: J2201.AUX_2@1 J2201.AUX_2@2
BATTERY_CHARGE
  Bottom 0.254: LV2C:GFE:U2204.14 21.85,55.11 21.59,55.37 21.59,57.91 21.08,58.42 21.08,58.93 20.83,59.18 20.83,59.69 22.23,61.09 22.23,73.27 Q2205.5-6-7-8
  Bottom 1.422: B1.1 20.83,77.44 21.08,76.2
  Bottom 1.778: 21.08,76.2 21.08,74.2 Q2205.5-6-7-8
BATTERY_CONNECT_CONTROL  (via drill 0.2)
  Route15 0.254: v22.35,53.59 23.11,54.36 23.11,56.39 23.5,56.77 23.5,58.8 22.61,59.69 22.61,60.45 24.13,61.98 24.13,69.98 24.38,70.23 v24.38,73.28
  Bottom 0.254: LV2C:GFE:U2204.13 23,54.24 v22.35,53.59 | Q2205.4 24.22,73.44 v24.38,73.28
BIAS_VOLTS_FOR_NTC_THERMISTOR
  Bottom 0.254: LV2C:GFE:U2204.9 25,49.89 24.38,49.28 23.5,49.28 23.11,48.9 23.11,46.48 22.99,46.35 22.99,44.96 21.6,43.57 R2209.1
BIN  (1 unrouted)
CAN1_H
  Top 0.254: J2201.CAN_H@1 J2201.CAN_H@2
  Bottom 0.254: R2.2 8.02,69.23 7.87,69.09
  Bottom 0.305: J2201.CAN_H@2 8.41,65.76 7.87,66.29 7.87,69.09 7.87,72.14 8.46,72.72 8.97,72.72
  Bottom 0.406: 8.97,72.72 LV2C:GFE:U2206.7
CAN1_L
  Top 0.254: J2201.CAN_L@1 J2201.CAN_L@2
  Bottom 0.254: J2201.CAN_L@2 9.39,64.51 9.91,65.02 9.91,70.87 | 9.91,70.87 9.91,71.03 10.32,71.45 | R2.1 9.84,70.93 9.91,70.87
  Bottom 0.406: 10.32,71.45 LV2C:GFE:U2206.6
CHARGE_TIMER
  Bottom 0.254: LV2C:GFE:U2204.6 25,62.77 C2219.2
CHASSIS
  Top 1.27: J2201.CHASSIS@1 4.88,69.77 J2201.CHASSIS@2 R2218.1
CPU_VBAT  (1 unrouted)
  Bottom 0.813: SJ281.2 C294.1
CPU_VREF  (1 unrouted)
  Bottom 0.406: C293.2 13.84,11.65 SJ280.2
CPU_XTAL1  (1 unrouted)
  Bottom 0.813: X281.P$1 6.78,23.09 C281.2
CPU_XTAL2  (2 unrouted)
  Bottom 0.813: X281.P$2 2.01,25.26 C282.2
DEBUG.13  (1 unrouted)
DEBUG.14  (1 unrouted)
DEBUG.15  (1 unrouted)
DOMINANT_BIT_STUCK_WHEN_HIGH
  Bottom 0.254: U$8.2 16.05,65.17 R15.1
  Bottom 0.813: C6.2 D1.A R15.1
EXT_VBAT  (1 unrouted)
EXT_VREF
  Bottom 0.254: SJ280.3 10.77,11.43 7.87,11.43 7.62,11.18 7.62,7.11 8.38,6.35 8.38,1.52 9.14,0.76 39.62,0.76 39.75,0.89 RA7.PAD
FB
  Bottom 0.254: LV2C:GFE:U2203.FB 29.9,57.33 30.73,58.17 30.73,62.23 30.95,62.45 C2223.1 32.07,62.23 32.51,62.23 33.15,61.59 33.15,51.69 32.77,51.31 32.3,51.31 R2216.1
  Bottom 1.016: R2217.2 R2216.1
GND  (via drill 0.2)  (57 unrouted)
  Top 0.254: 25.02,65.96 C2201.2 | 25.52,71.03 C2205.2 | LV2C:GFE:U2201.VSS@6 22.99,8.68 22.99,8.38 23.5,7.87 v24.38,7.87 | LV2C:GFE:U2201.VSS@5 27.73,13.84 v28.45,13.84 | LV2C:GFE:U2201.VSS 25.76,26.67 v25.91,26.67 | LV2C:GFE:U2201.VSS@1 12.47,27.69 v11.94,27.69 | LV2C:GFE:U2201.VSS@2 9.14,23.94 9.14,24.38 8.51,25.02 5.71,25.02 4.97,24.27 C287.1 | LV2C:GFE:U2201.VSS@4 13.97,7.1 v14.1,6.99 | LV2C:GFE:U2201.VSS@3 7.55,12.7 v7.37,12.7
  Top 0.406: R2218.2 5.59,50.31 v5.59,49.02 | v4.83,49.02 4.83,50.29 4.06,50.29 | 4.06,50.29 v4.06,49.02 | 4.06,50.29 v3.3,50.29
  Top 0.61: 16.76,60.2 v15.62,60.2 16.43,59.26 L2203.2 | v24.13,51.69 24.13,50.57 C2207.1 v23.5,51.69 | 25.02,65.96 25.02,68.2 25.52,68.7 LV2C:GFE:U2202.GND | Q2251.2 14.9,52.07 15.75,52.07 16.28,51.54 U2251.2 16.26,50.98 16.26,49.78 18.16,49.78 18.16,51.69 18.44,51.96 U2250.4 | v17.27,58.29 17.27,59.69 | C2206.- 24.35,43.22 21.73,45.83 Q2282.2 21.3,45.87 R2251.1 | TVS2201.A 27.01,57.11 | R2255.1 11.7,51.66 C2250.1
  Top 0.813: LV2C:GFE:U2202.GND 25.52,71.03 | R2206.1 28.56,72.25 28.96,72.64 | 28.96,72.64 28.96,74.71 C2203.1 | 28.96,72.64 29.27,72.96 R2202.1 | D2201.ANODE2 D2201.ANODE1 20.32,66.77 20.32,65.53 20.31,65.02 C2202.2
  Route2 0.254: v14.22,67.54 14.12,67.54
  Route2 0.406: v3.3,50.29 3.3,49.02 v4.06,49.02 | v5.59,49.02 v4.83,49.02 | v15.67,73.23 15.75,73.23
  Route2 0.61: v15.07,56.64 14.99,56.81
  Bottom 0.254: LV2C:GFE:U2203.PGND@1 LV2C:GFE:U2203.PGND | LV2C:GFE:U2203.GND 29.03,56 29.08,55.94 | 14.76,67.54 U$8.4 v14.22,67.54 | C12.2 14.07,6.96 v14.1,6.99
  Bottom 0.305: R8.2 15.49,55.37 v15.07,56.64
  Bottom 0.406: LV2C:GFE:U2206.2 15.67,72.72 v15.67,73.23 | LV2C:GFE:U2204.PGND 26.42,56.56 26.42,60.71 C2221.1
  Bottom 0.61: v17.27,58.29 17.27,60.45 17.82,61 C6.1
  Bottom 0.813: 28.61,55.94 28.55,55.88 26.67,55.88 25.99,56.56 LV2C:GFE:U2204.PGND
  Bottom 1.016: C2224.1 30.86,56.39 29.08,55.94 28.61,55.94 LV2C:GFE:U2203.PGND@1 | C2252.1 24.16,43.42 C2252A.1 24.03,41.66 R2214.2
  Bottom 1.27: C2220.1 27.22,62.79 C2221.1
  other vias: 31.11,57.66 17.65,53.09 14.99,53.98 25.78,70.48
  pour Bottom (isolate 0.254, rank 4): 100.08,0 0,0 0,80.01 100.08,80.01 100.08,71.63
  pour Top (isolate 0.254, rank 4): 0,0 0,80.01 100.08,80.01 100.08,0
  pour Route2 (isolate 0.254, rank 4): 0,80.01 100.08,80.01 100.08,0 0,0
IN+
  Top 0.61: C2251.1 R2255.2 13.34,52.92 R2254.1 15.12,51.19 U2251.3
IN_CURRENT_LIMIT_PROG
  Bottom 0.254: LV2C:GFE:U2204.3 23.5,58.8 22.61,59.69 22.61,60.58 22.86,60.96 22.86,66.81 R2208.1
INV-INV  (2 unrouted)
  Bottom 0.254: U$8.5 U$8.6 | 15.49,68.33 16,68.33 | 16,68.07 15.49,68.07
  Bottom 0.305: R5.1 15.2,68.5 U$8.5
INV_DATA
  Bottom 0.254: 17.27,66.21 16.76,66.55 16.76,66.72 U$8.1 | R15.2 17.56,65.5
  Bottom 0.406: 17.02,66.29 16.64,66.67
  Bottom 0.61: 17.56,65.5 17.02,66.29 16.76,66.55
  Bottom 0.813: D1.K R15.2
IO_3P3  (via drill 0.2)
  Route15 0.254: v17.27,68.07 17.27,70.92 16.7,71.5 v15.62,71.5
  Bottom 0.254: U$8.8 17.27,67.54 v17.27,68.07
  Bottom 0.305: 17.89,67.54 U$8.8
  Bottom 0.406: LV2C:GFE:U2206.3 15.62,71.45 v15.62,71.5
  Bottom 0.61: R7.1 17.89,67.54
IO_GND  (4 unrouted)
  pour Bottom (rank 3): 9.91,61.98 10.67,62.74 13.46,62.74 14.22,61.98 14.22,58.17 15.24,57.15 17.53,57.15 17.53,54.86 14.99,54.86 13.21,53.09 9.91,53.09
L_IN
  Bottom 0.254: LV2C:GFE:U2203.L1 28.03,53.63 27.81,53.47
  Bottom 0.406: 27.81,53.34 27.81,53.47
  Bottom 0.813: 27.81,53.34 26.87,52.65 L2202.1
L_OUT
  Bottom 0.254: LV2C:GFE:U2203.L2 29.03,53.65 29.08,53.21 29.08,53.09
  Bottom 0.61: L2202.2 29.67,52.5
  Bottom 0.813: 29.67,52.5 29.08,53.09
  Bottom 1.016: L2202.2 29.67,47.81 CR2201.A
LED200_A
  Bottom 0.61: D282.A 15.91,6.38 R290.2
MAX_UVLO
  Top 0.406: U2250.6 21.7,50.93 21.34,50.93 20.49,50.08 R2250.1
  Top 0.61: R2250.1 19.6,49.08 R2251.2 18.66,47.01 Q2282.3
N$2
  Top 0.406: J2201.B+@1 J2201.B+@2
  Top 1.016: L2203.4 11.51,66.47 10.67,67.31 9.16,67.31 J2201.B+@2
N$3
  Top 0.254: LV2C:GFE:U2202.VC 28.85,69.24 29.45,69.84 R2203.2
N$4
  Top 0.254: LV2C:GFE:U2202.RT 27.32,69.74 27.43,69.85 28.7,69.85 29.86,71 R2202.2
N$5
  Top 0.813: R2203.1 31.05,68.14 31.75,68.83 31.75,74.42 31.5,74.68 30.82,74.68 C2203.2
N$6  (2 unrouted)
  Bottom 0.254: 14.99,66.55 15.49,67.06 | 14.99,66.29 15.49,66.8
  Bottom 0.305: 15.02,66.4 U$8.3
  Bottom 0.61: R6.2 15.02,66.4
N$7
  Bottom 0.813: D2202.1(ANODE) R2213.2
N$10
  Bottom 1.016: R2214.1 22.32,38.77 R2215.2
N$13  (3 unrouted)
  Bottom 0.254: 34.29,3.05 40.13,3.05 | 34.29,3.56 40.13,3.56 | 34.42,7.75 40.26,7.75 | 34.42,7.24 40.26,7.24
N$14  (1 unrouted)
  Bottom 0.254: 34.42,5.71 40.26,5.71 | 34.42,5.21 40.26,5.21
N$15  (1 unrouted)
  Bottom 0.254: 34.42,9.78 40.26,9.78 | 34.42,9.27 40.26,9.27
N$16  (1 unrouted)
  Bottom 0.254: 34.42,11.81 40.26,11.81 | 34.42,11.3 40.26,11.3
N$17  (1 unrouted)
  Bottom 0.254: 34.42,13.97 40.26,13.97 | 34.42,13.46 40.26,13.46
N$18  (1 unrouted)
  Bottom 0.254: 34.42,30.23 40.26,30.23 | 34.42,29.72 40.26,29.72
N$19  (1 unrouted)
  Bottom 0.254: 34.42,32.26 40.26,32.26 | 34.42,31.75 40.26,31.75
N$22  (1 unrouted)
  Bottom 0.254: 34.42,18.03 40.26,18.03 | 34.42,17.53 40.26,17.53
N$23  (1 unrouted)
  Bottom 0.254: 34.42,16 40.26,16 | 34.42,15.49 40.26,15.49
N$24  (1 unrouted)
  Bottom 0.254: 34.42,20.07 40.26,20.07 | 34.42,19.56 40.26,19.56
N$25  (1 unrouted)
  Bottom 0.254: 34.42,22.1 40.26,22.1 | 34.42,21.59 40.26,21.59
N$26  (1 unrouted)
  Bottom 0.254: 34.42,24.13 40.26,24.13 | 34.42,23.62 40.26,23.62
N$27  (1 unrouted)
  Bottom 0.254: 34.42,26.16 40.26,26.16 | 34.42,25.65 40.26,25.65
N$28  (1 unrouted)
  Bottom 0.254: 34.42,28.19 40.26,28.19 | 34.42,27.69 40.26,27.69
N_DRAIN
  Top 0.254: R2253.1 18.54,60.45 18.54,54 | 18.54,54 18.54,53.72 20.75,53.72 U2250.2 | Q2251.3 18.54,54
N_GATE
  Top 0.61: C2251.2 14.76,55.09 Q2251.1 15.41,54.95 16.26,54.1 16.26,53.21 17.23,52.24 U2251.1
NTC_INPUT_FROM_BATTERY
  Bottom 0.254: 21.75,41.4 21.84,41.4 22.61,42.16 22.61,43.69 23.5,44.58 23.5,45.85 23.62,45.97 23.62,48.64 23.75,48.77 24.64,48.77 25.5,49.63 LV2C:GFE:U2204.8
  Bottom 1.016: R2215.1 21.75,41.4 21.75,41.5 R2209.2
P_GATE
  Top 0.61: U2250.3 19.8,56.01 Q2250.3
PIC_LAMP
  Bottom 0.61: D281.A 20,4.57 R289.1
PORT0.0/RD1/TXD3/SDA1  (2 unrouted)
  Bottom 0.254: 18.29,50.29 19.56,51.56 19.56,59.18 20.07,59.69 20.07,61.21 21.34,62.48 21.34,66.29 17.45,70.18 LV2C:GFE:U2206.4
PORT0.1/TD1/RXD3/SCL1  (2 unrouted)
  Bottom 0.254: LV2C:GFE:U2206.1 15.32,73.99 14.73,73.41 14.73,70.1 15.49,69.34 16,69.34 16.55,68.79 U$8.7 16.55,68.83 17.78,68.83 20.7,65.91 20.7,62.87 19.43,61.59 19.43,60.07 18.92,59.56 18.92,51.82 17.78,50.67
PORT0.2/TXD0  (3 unrouted)
PORT0.3/RXD0  (3 unrouted)
PORT0.4/I2SRX_CLK/RD2/CAP2.0  (via drill 0.2)  (2 unrouted)
  Top 0.254: v16.51,43.94 16.51,43.18
  Bottom 0.254: R6.1 11.43,66 11.43,65.79 12.95,64.26 13.72,64.26 14.73,63.25 14.73,58.93 16,57.66 18.03,57.66 18.29,57.4 18.29,52.07 16.51,50.29 v16.51,43.94
  Bottom 0.406: R5.2 LV2C:GFE:U2206.5
  Bottom 0.813: R6.1 R5.2
PORT0.5/I2SRX_WS/TD2/CAP2.1  (1 unrouted)
PORT0.6/I2SRX_SDA/SSEL1/MAT2.0  (1 unrouted)
PORT0.7/I2STX_CLK/SCK1/MAT2.1  (1 unrouted)
PORT0.8/I2STX_WS/MISO1/MAT2.2  (1 unrouted)
PORT0.9/I2STX_SDA/MOSI1/MAT2.3  (1 unrouted)
PORT0.10/TXD2/SDA2/MAT3.0  (1 unrouted)
PORT0.11/RXD2/SCL2/MAT3.1  (1 unrouted)
PORT0.15/TXD1/SCK0/SCK  (1 unrouted)
PORT0.16/RXD1/SSEL0/SSEL  (1 unrouted)
PORT0.17/CTS1/MISO0/MISO  (1 unrouted)
PORT0.18/DCD1/MOSI0/MOSI  (1 unrouted)
PORT0.19/DSR1/MCICLK/SDA1  (1 unrouted)
PORT0.20/DTR1/MCICMD/SCL1  (1 unrouted)
PORT0.21/RI1/MCIPWR/RD1  (1 unrouted)
PORT0.22/RTS1/MCIDAT0/TD1  (1 unrouted)
PORT0.23/AD0.0/I2SRX_CLK/CAP3.0  (1 unrouted)
PORT0.24/AD0.1/I2SRX_WS/CAP3.1  (1 unrouted)
PORT0.25/AD0.2/I2SRX_SDA/TXD3  (1 unrouted)
PORT0.26/AD0.3/AOUT/RXD3  (1 unrouted)
PORT0.27/SDA0  (1 unrouted)
PORT0.28/SCL0  (1 unrouted)
PORT0.29/USB_D+  (2 unrouted)
  Bottom 0.254: R281.2 10.2,50.29
  Bottom 0.813: C290.2 R281.2
PORT0.30/USB_D-  (2 unrouted)
  Bottom 0.61: C289.2 13.2,49.52 13.21,49.53
  Bottom 1.016: 13.21,49.53 15.38,49.53 R282.2
PORT1.0/GPIO_SPS_DISABLE  (2 unrouted)
PORT1.1/GPIO_SPS_V-IN_GOOD  (via drill 0.2)  (2 unrouted)
  Top 0.254: U2250.5 20.75,51.49 20.32,51.05 19.81,51.05 19.3,50.55 v19.3,50.04
PORT1.4/GPIO_SPS_5V-OUT_GOOD  (2 unrouted)
  Top 0.254: LV2C:GFE:U2202.PG 27.78,68.24 28.96,67.06 28.96,63.37 30.48,61.85 30.48,57.91
PORT1.8/GPIO_CHARGER_DISABLE_A  (via drill 0.2)  (2 unrouted)
  Route15 0.254: v23.36,59.82 23.37,59.56
  Bottom 0.254: LV2C:GFE:U2204.4 24,58.93 23.37,59.56 v23.37,59.81 v23.36,59.82
PORT1.9/GPIO_CHARGER_DISABLE_B  (via drill 0.2)  (2 unrouted)
  Route15 0.254: v24.25,59.68 24.26,59.44
  Bottom 0.254: v24.25,59.68 24.25,59.42 24.5,59.17 LV2C:GFE:U2204.5
PORT1.10/GPIO_!BAT_CHARGING!  (2 unrouted)
  Bottom 0.254: LV2C:GFE:U2204.11 24,53.97 23.62,53.59 arc53 23.37,52.83 23.37,52.7 22.73,52.07 22.73,51.44 23.33,50.84 D2202.2(CATHODE) 22.86,49.92 22.86,49.53 22.61,49.28 22.61,46.74 22.48,46.61 22.48,45.34 21.84,44.7 20.57,44.7 20.32,44.45 20.32,41.4 20.57,41.15 20.57,38.35 20.83,38.1
PORT1.14/GPIO_HAP_3.3V_DISABLE  (2 unrouted)
PORT1.15/GPIO_SPS_5V_PWR_GOOD  (1 unrouted)
PORT1.16/ENET_MDC  (via drill 0.2)  (1 unrouted)
  Top 0.254: LV2C:GFE:U2201.P1[16]/ENET_MDC 22.05,12.45 21.08,12.45 18.54,9.91 18.29,9.91 v17.53,9.14
  Bottom 0.254: 17.78,6.54 R290.1 17.64,7.76 v17.53,9.14
PORT1.17/ENET_MDIO  (via drill 0.2)  (1 unrouted)
  Top 0.254: LV2C:GFE:U2201.P1[17]/ENET_MDIO 21.85,11.94 21.34,11.94 v18.54,9.14
  Bottom 0.254: R289.2 21.7,7.25 21.34,7.62 18.8,7.62 v18.54,9.14
PORT1.18/GPIO_USB_HIGH_SPEED_SELECT  (2 unrouted)
PORT1.19/CAP1.1  (1 unrouted)
PORT1.20/PWM1.2/SCK0  (1 unrouted)
PORT1.21/PWM1.3/SSEL0  (1 unrouted)
PORT1.22/MAT1.0  (1 unrouted)
PORT1.23/PWM1.4/MISO0  (1 unrouted)
PORT1.24/PWM1.5/MOSI0  (1 unrouted)
PORT1.25/MAT1.1  (1 unrouted)
PORT1.26/PWM1.6/CAP0.0  (1 unrouted)
PORT1.27/CAP0.1  (1 unrouted)
PORT1.28/PCAP1.0/MAT0.0  (1 unrouted)
PORT1.29/PCAP1.1/MAT0.1  (1 unrouted)
PORT1.30/VBUS/AD0.4  (1 unrouted)
PORT1.31/GPIO_BAT_CHRG_MONITOR  (2 unrouted)
  Bottom 0.254: LV2C:GFE:U2204.12 23.5,54.11 23.11,53.72 22.99,53.47 22.73,52.83 22.44,52.54 R2207.1
PORT2.0/PWM1.1/TXD1/TRACECLK  (1 unrouted)
PORT2.1/PWM1.2/RXD1/PIPESTAT0  (1 unrouted)
PORT2.2/PWM1.3/CTS1/PIPESTAT1  (1 unrouted)
PORT2.3/PWM1.4/DCD1/PIPESTAT2  (1 unrouted)
PORT2.4/PWM1.5/DSR1/TRACESYNC  (1 unrouted)
PORT2.5/PWM1.6/DTR1/TRACEPKT0  (1 unrouted)
PORT2.6/PCAP1.0/RI1/TRACEPKT1  (1 unrouted)
PORT2.7/RD2/RTS1/TRACEPKT2  (1 unrouted)
PORT2.8/TD2/TXD2/TRACEPKT3  (1 unrouted)
PORT2.9/USB_CONNECT/RXD2/EXTIN0  (1 unrouted)
PORT2.10/!EINT0!  (via drill 0.2)  (2 unrouted)
  Top 0.254: LV2C:GFE:U2201.P2[10]/#EINT0 7.92,14.48 5.08,14.48 4.83,14.22 v4.83,13.46
  Bottom 0.254: v4.83,13.46 3.81,13.46 3.05,12.7 1.27,12.7 0.76,13.21 0.76,32 0.81,32.05 R283.1 1.84,38.42 2.4,38.97 J2204.10
PORT2.11/!EINT1!/MCIDAT1/I2STX_CLK
  Top 0.254: LV2C:GFE:U2201.P2[11]/#EINT1/MCIDAT1/I2STX_CLK 7.72,14.99 4.83,14.99 4.06,14.22 4.06,9.4 4.32,9.14 6.35,9.14 8.89,6.6 8.89,1.78 9.4,1.27 37.59,1.27 37.72,1.4 J2.11.PAD
PORT2.12/!EINT2!/MCIDAT2/I2STX_WS
  Top 0.254: LV2C:GFE:U2201.P2[12]/#EINT2/MCIDAT2/I2STX_WS 7.77,15.75 4.83,15.75 3.56,14.48 3.56,8.89 3.81,8.64 6.1,8.64 8.38,6.35 8.38,1.52 9.14,0.76 38.61,0.76 38.73,0.89 J2.12.PAD
PORT2.13/!EINT3!/MCIDAT3/I2STX_SDA  (1 unrouted)
PORT3.25/MAT0.0/PWM1.2  (1 unrouted)
PORT3.26/MAT0.1/RXD3  (1 unrouted)
PORT4.28/MAT2.0/TXD3  (1 unrouted)
PORT4.29/MAT2.1/RXD3  (1 unrouted)
PROTECTED_DC_POWER  (via drill 0.2)
  Route2 0.254: v22.36,59.05 22.36,60.31 22.73,60.71 26.67,60.71 27.05,60.33 v27.18,59.31
  Route15 0.254: v27.18,59.31 27.05,54.86 v26.42,54.61 26.42,54.36 25.4,53.34 25.4,51.31 v20.07,46.23
  Bottom 0.254: LV2C:GFE:U2203.VIN 27.05,54.38 v26.42,54.61 | C2221.2 28.92,59.91 28.45,59.44 27.3,59.44 v27.18,59.31 | LV2C:GFE:U2204.2 23,58.42 v22.36,59.05 | v20.07,46.23 R2213.1
  Bottom 0.406: R2211.2 27.5,64.83 28.89,63.44 C2220.2
  Bottom 0.813: Q2205.1-2-3 23.33,74.78 R2212.2 23.37,77.27 23.37,78.99 v26.67,78.99 v27.43,78.99 | v27.43,78.99 27.47,78.99 | R2211.2 27.43,64.99 27.43,72.39 26.28,73.54 Q2204.1-2-3 | v27.43,78.99 v28.19,78.99
  Bottom 1.016: 23.33,74.78 23.33,74.54 Q2204.1-2-3
  Bottom 1.27: C2220.2 28.92,62.79 C2221.2
REF
  Top 0.61: U2251.4 U2251.5
RTC_XTAL-A  (1 unrouted)
  Bottom 0.813: C283.2 5.84,16.22 X282.P$2
RTC_XTAL-B  (1 unrouted)
  Bottom 0.813: C284.2 2.44,15.96 X282.P$1
RTCK  (2 unrouted)
SH_GND
  Top 0.406: J2201.B-@1 J2201.B-@2 arc90 8.95,58.17
  Top 1.016: L2203.1 10.41,57.91 9.21,57.91 J2201.B-@2
SLOPECONTROL
  Bottom 0.406: R1.2 11.44,73.99 LV2C:GFE:U2206.8
SOFT_START  (1 unrouted)
  Top 0.254: LV2C:GFE:U2202.RUN/SS 24.26,67.74 24.26,64.64 27.81,64.64 27.81,61.31 C2225.2
  Top 1.016: R2204.1 27.21,60.89
SPS-5V  (via drill 0.2)  (3 unrouted)
  Top 0.254: LV2C:GFE:U2202.BD 23.48,69.74 23.11,70.1 | 23.11,70.1 22.61,70.61 22.61,73.91 23.77,75.08 24.27,75.08 | 13.21,48.77 13.34,48.9 R2254.2 | v23.5,70.48 23.11,70.1
  Top 0.406: 26.54,75.09 R2205.2
  Top 0.813: v27.3,76.58 27.3,75.22 R2205.2 27.21,75.41 26.92,75.69 27.43,75.69 27.69,75.95 27.94,75.95 | v28.83,76.58 28.19,75.95 27.94,75.95 | 27.94,75.95 27.69,76.2 v28.07,76.58
  Top 1.27: C2205.1 26.54,75.09
  Top 1.422: CR2250.A 13.21,46.68 13.21,48.77
  Top 1.676: L2201.2 15.01,75.82 23.4,75.82 24.27,75.08 C2205.1
  Route2 0.254: v25.65,59.44 25.53,58.8 25.53,57.4 21.59,57.4 v21.59,59.44
  Route15 0.254: v21.59,59.44 21.59,60.45 23.5,62.36 v23.5,70.48
  Route15 0.813: v12.95,48.26 12.95,50.04 12.19,50.8 12.19,73.66 v15.62,75.44 | v13.72,48.26 13.72,50.04 12.95,50.8 12.95,73.41 v16.76,75.44
  Bottom 0.254: LV2C:GFE:U2204.1 21.59,58.67 v21.59,59.44 | LV2C:GFE:U2204.7 25.5,58.77 v25.65,59.44
  Bottom 0.61: 29.21,72.64 R3.2
  Bottom 0.813: Q2204.5-6-7-8 28.53,75.36 v27.3,76.58 | 28.19,75.18 28.07,75.18 v28.07,76.58 v28.83,76.58 28.83,75.82
  Bottom 1.778: Q2204.5-6-7-8 28.45,74.7 29.21,72.64
SPS_3P3_LED
  Bottom 0.61: R2241.1 28.26,44.39 28.98,43.66 D2203.1(ANODE)
SPS_5_REG  (1 unrouted)
  Bottom 1.016: CR2201.C 26.35,45.74 C2252.2 26.57,43.67 C2252A.2 26.95,37.29
SPS_SYNC  (via drill 0.2)  (2 unrouted)
  Top 0.254: LV2C:GFE:U2202.SYNC 27.51,67.74 28.45,66.8 28.45,63.12 29.97,61.59 29.97,57.91
  Bottom 0.254: LV2C:GFE:U2203.PS/SYNC v28.07,58.29
TCK  (2 unrouted)
TDI  (2 unrouted)
TDO  (2 unrouted)
TMS  (2 unrouted)
USB_D+
  Top 0.254: J2201.USB_H@2 J2201.USB_H@1
  Bottom 0.254: J2201.USB_H@2 6.12,63.27 5.49,62.59 5.49,57.78 5.97,57.28 L281.1
  Bottom 0.61: L281.1 U282.6
USB_D-
  Top 0.254: J2201.USB_L@1 J2201.USB_L@2
  Bottom 0.254: J2201.USB_L@2 9.35,62 9.42,62 10.46,63.04 13.41,63.04 14.22,62.23 14.22,59.69 13.74,59.2 U282.4
  Bottom 0.61: U282.4 L282.1
USBD+
  Bottom 0.406: L281.2 8.48,53.2 R291.1
  Bottom 0.813: R281.1 L281.2
USBD-
  Bottom 0.406: L282.2 R282.1
V+
  Top 0.61: 16.58,45.54 CR2250.C 17.23,46.7 U2251.6
  Top 0.813: CR2250.C 16.83,46.04 15.24,44.45 11.68,44.45 11.18,44.96 11.18,49.44 C2250.2
V_BOOST
  Top 0.254: LV2C:GFE:U2202.BOOST 23.22,69.24 22.1,70.36 22.1,73.92 21.72,74.3 21.54,74.47 C2204.1
V_FEEDBACK  (via drill 0.2)
  Top 0.254: R2206.2 26.86,71.05 27.29,70.62 v28.42,70.62 | LV2C:GFE:U2202.FB 28.04,68.74 29.85,66.93 v30.68,66.93
  Top 0.406: R2206.2 R2205.1
  Route2 0.254: v30.68,66.93 29.28,69.52 v28.42,70.62
V_SWITCH  (2 unrouted)
  Top 0.254: LV2C:GFE:U2202.SW 22.1,68.74 D2201.CATHODE
  Top 1.016: D2201.CATHODE 19.47,71.37
  pour Top (isolate 0.254): 20.4,73.56 20.24,74.07 20.22,75.21 18.11,75.23 17.98,75.23 16.54,74.78 8.81,74.68 8.81,73.81 8.94,70.36 8.92,69.06 21.46,69.32 21.49,69.8 21.49,72.87 21.46,73.53
VIN
  Top 0.254: LV2C:GFE:U2202.VIN 23.53,68.24 23.37,68.07 23.37,65.18 C2202.1 22.32,64.13 R2252.2 | R2253.2 21.88,63.1 R2252.2 | R2252.2 22.41,63.26 24.38,63.26 | 24.38,63.26 C2201.1 | R2204.2 24.38,60.52 24.38,63.26
  pour Top (isolate 0.254, no thermals): 23.85,60.55 23.85,61.57 21.08,61.59 21.08,62.1 19.41,62.08 19.66,63.73 21.26,63.73 21.36,65.46 23.7,65.46 23.65,63.09 24.87,63.09 24.89,61.21 24.87,60.55
VINA
  Bottom 0.254: LV2C:GFE:U2203.EN 27.43,57.43 27.43,58.55 27.81,58.93 28.45,58.93 28.7,58.67 | 28.7,58.67 28.7,58.17 28.53,57.74 LV2C:GFE:U2203.VINA | R2211.1 30.1,64.03 30.1,59.31 29.72,58.93 28.96,58.93 28.7,58.67
  Bottom 0.813: 29.21,65.79 29.18,66.83 R4.2
  Bottom 1.016: C2222.2 29.45,69.43 arc90 R3.1 | R2211.1 29.21,65.79
  Bottom 1.422: R4.2 29.21,67 R3.1
VS
  Top 0.254: 25.72,49.38 C2207.2 26,50.86 TVS2201.C 25.3,55.58 22.83,55.58 Q2250.4 22.08,54.94 U2250.1 | 25.72,49.38 C2206.+ 22.25,50.1 R2250.2 | 25.72,49.38 27.37,47.72 LV2C:GFE:F2201.2
  pour Top (isolate 0.254): 22.38,45.85 22.35,53.09 21.34,53.59 21.31,56.44 22.73,56.39 24.26,55.5 27.64,55.55 28.45,54.36 28.45,52.83 27.18,51.82 27.18,49.28 29.16,48.26 29.18,45.31 22.94,45.31
VS_SENSE
  Top 0.254: Q2250.2 Q2250.1 20.07,58.23 | 20.07,58.23 Q2250.6 Q2250.5 | R2252.1 21.57,60.52 20.57,59.69 20.07,59.18 20.07,58.23
  pour Top (isolate 0.254, no thermals): 19.08,57.28 19.05,59.79 20.88,59.79 21.41,60.68 22.96,60.76 23.01,59.54 22.53,59.03 22.53,57.28